# Altium project Relay-Driver-Board-v1.0.PrjPcb (part 4 of 5)
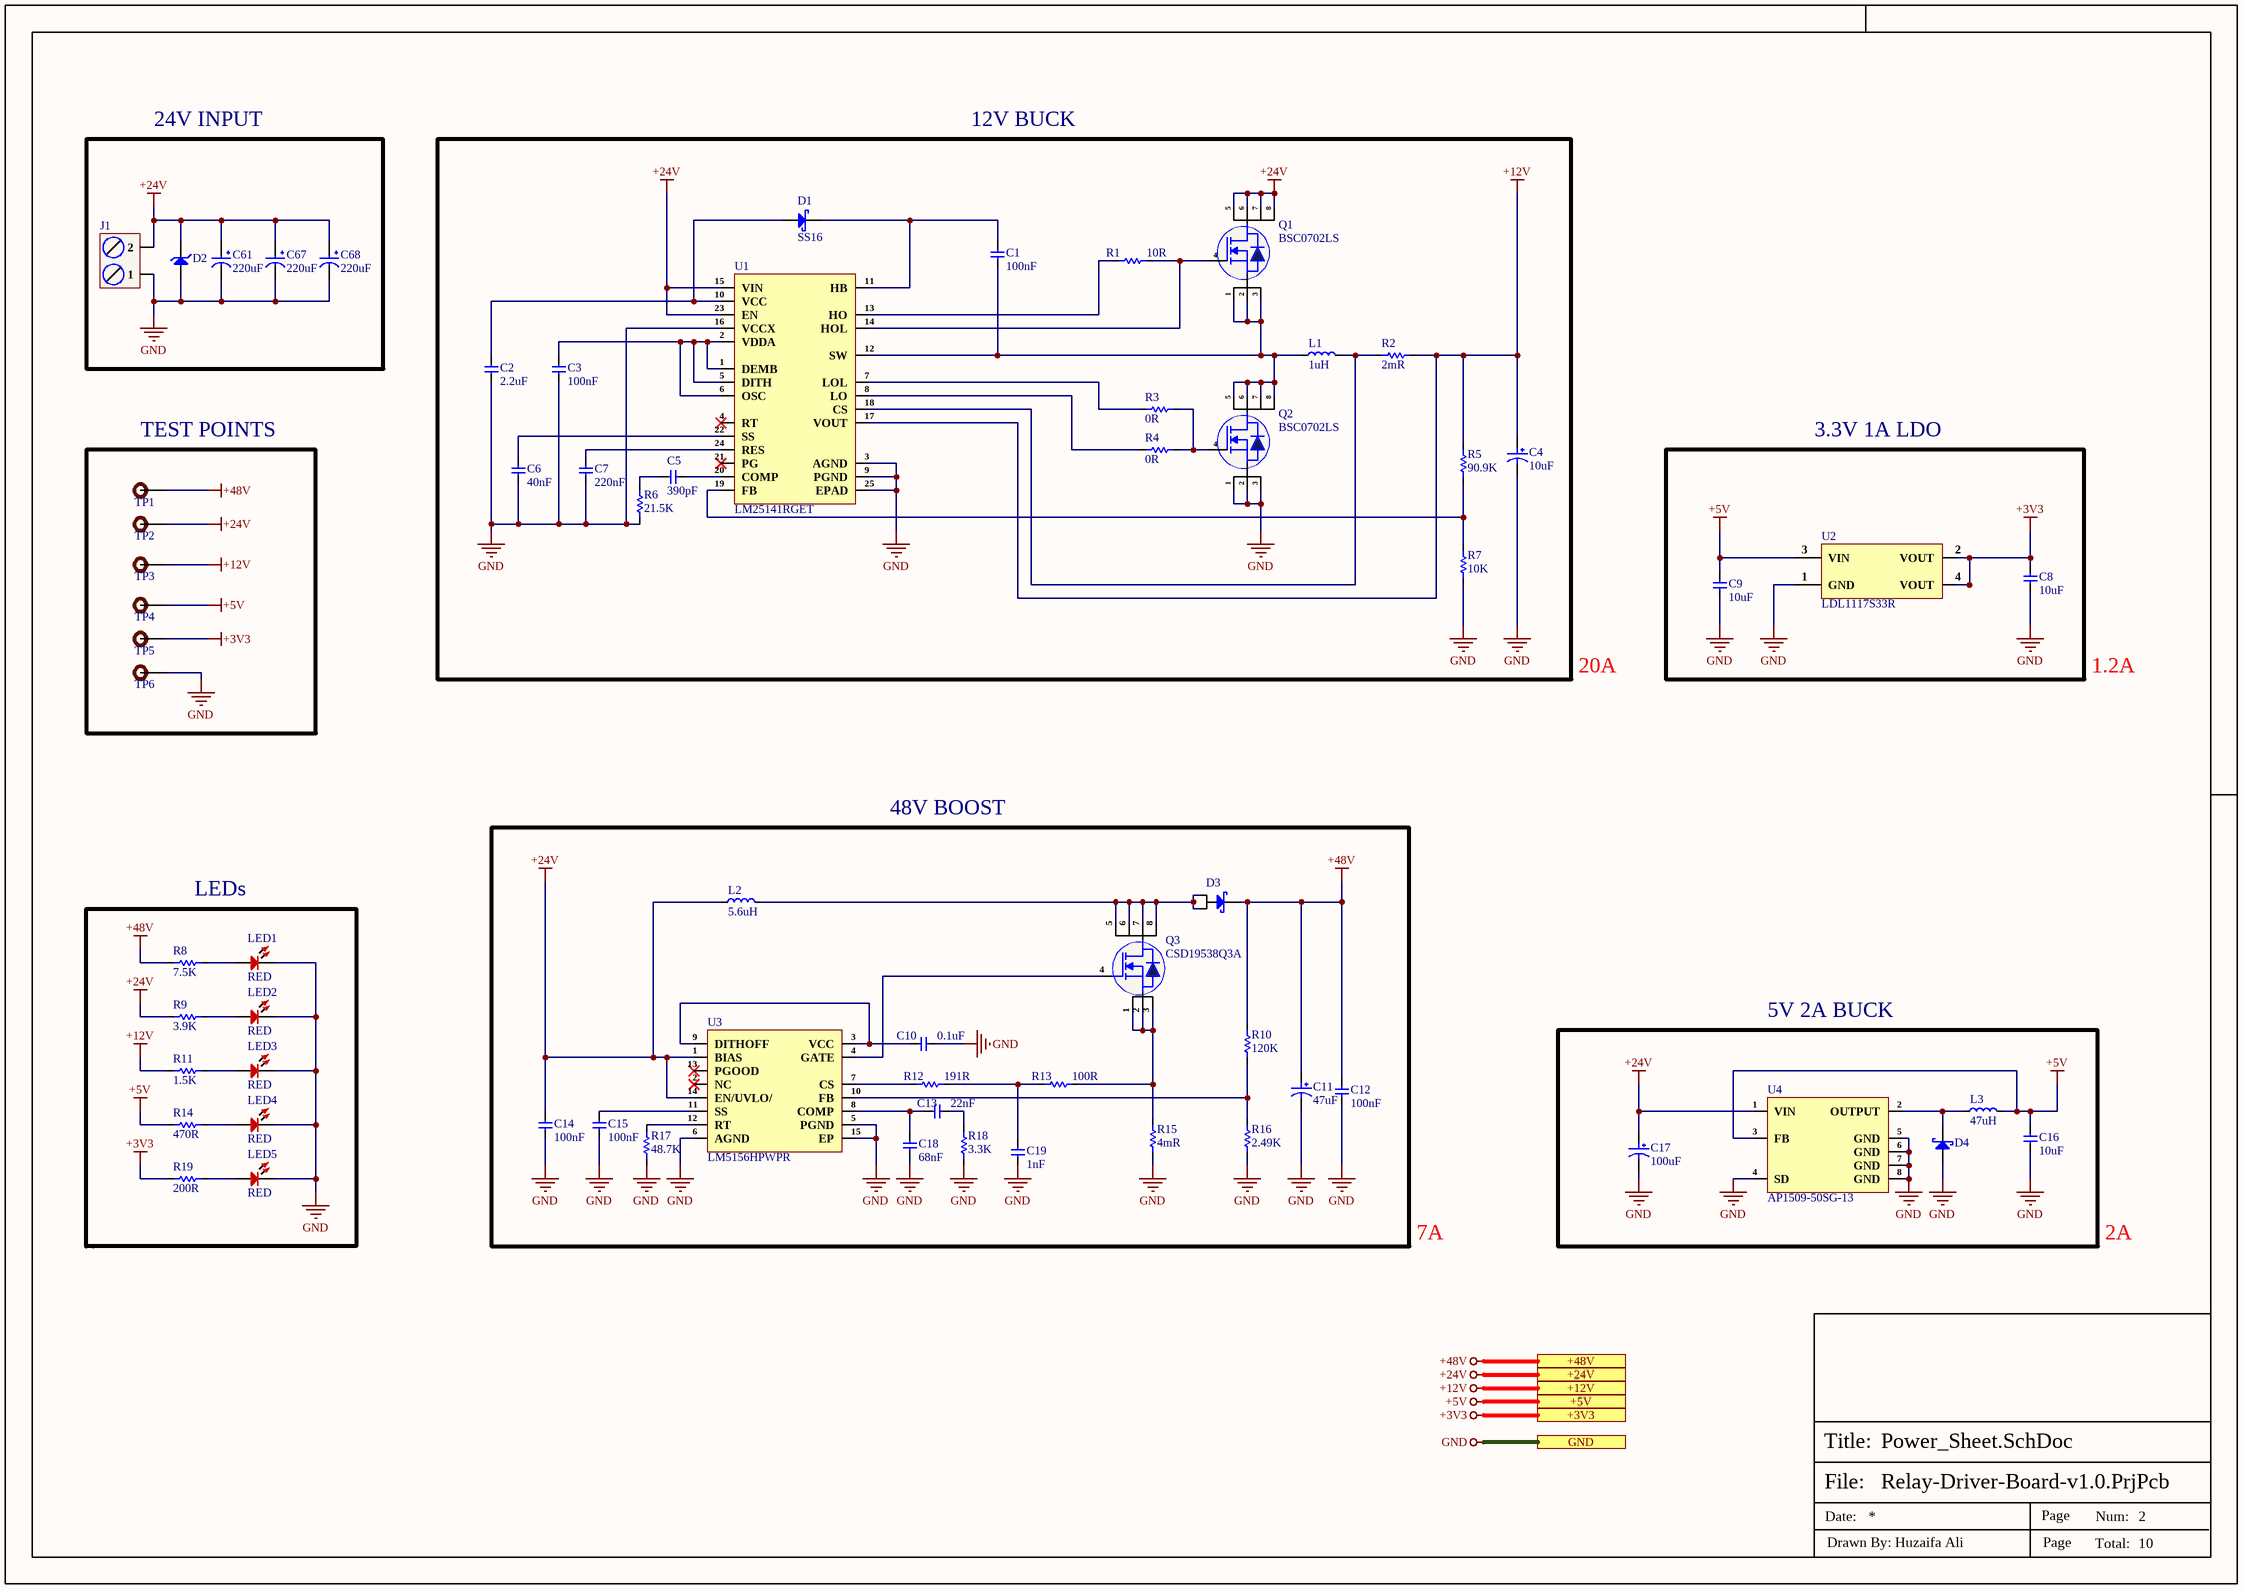
[diagram p10: Power_Sheet.SchDoc]

## Sheet Power_Sheet.SchDoc (continued)
### Library data of the parts
C1 C3 C12 C14 C15 = C1005X7R1H104KT000F: CAP CER 0.1UF 50V X7R 0402; Manufacturer: TDK; Tolerance: 10%; Voltage: 25V; Item Type: Capacitor; Supplier 1: Avnet; Manufacturer Part Number: C1005X7R1H104KT000F; RoHS: No; Category: Ceramic Capacitors; Dielectric: X7R; Supplier Part Number 1: C1005X7R1H104KT000F; LCSC Part Number: C361198; ComponentLink1Description: LCSC; ComponentLink1URL: https://www.lcsc.com/product-detail/Multilayer-Ceramic-Capacitors-MLCC-SMD-SMT_TDK-C1005X7R1H104KT000F_C361198.html
C2 = C2012X5R1H225K125AB: CAP CER 2.2UF 50V X5R 0805; Manufacturer: TDK; Dielectric Material: 4241ConductorMaterial; Item Type: Capacitor; Supplier: Avnet; Supplier Part Number: C2012X5R1H225K125AB; Manufacturer Part Number: C2012X5R1H225K125AB; RoHS: Yes; Category: Ceramic Capacitors; Stock: 6000; Pricing: 2000=0.08532 (USD); Material: 4241ConductorMaterial; Lead Free: 5697LeadFree; ComponentLink1URL: https://datasheet.ciiva.com/24216/c2012x5r1h225k125ab-264892-24216756.pdf?src-supplier=Mouser; ComponentLink1Description: https://datasheet.ciiva.com/24216/c2012x5r1h225k125ab-264892-24216756.pdf?src-supplier=Mouser; ComponentLink2URL: https://datasheet.ciiva.com/6287/tdkmlcccaprange-6287487.pdf?src-supplier=Digikey; ComponentLink2Description: https://datasheet.ciiva.com/6287/tdkmlcccaprange-6287487.pdf?src-supplier=Digikey; ComponentLink3URL: https://datasheet.ciiva.com/6287/tdkmlcccaprange-6287494.pdf?src-supplier=Digikey; ComponentLink3Description: https://datasheet.ciiva.com/6287/tdkmlcccaprange-6287494.pdf?src-supplier=Digikey; ComponentLink4URL: https://datasheet.ciiva.com/6287/tdkmlcccaprange-6287500.pdf?src-supplier=Digikey; ComponentLink4Description: https://datasheet.ciiva.com/6287/tdkmlcccaprange-6287500.pdf?src-supplier=Digikey; ComponentLink5URL: https://datasheet.ciiva.com/28451/1796654-28451710.pdf?src-supplier=Element14; ComponentLink5Description: https://datasheet.ciiva.com/28451/1796654-28451710.pdf?src-supplier=Element14; ComponentLink6URL: https://datasheet.ciiva.com/22725/1913358-22725562.pdf?src-supplier=Element14; ComponentLink6Description: https://datasheet.ciiva.com/22725/1913358-22725562.pdf?src-supplier=Element14
C4 = 50SVPF10M: CAP ALUM POLY 10UF 20% 50V SMD; Manufacturer: Panasonic; Material: 4242ConductorMaterial; Item Type: Capacitor; Supplier: Mouser; Supplier Part Number: 667-50SVPF10M; Manufacturer Part Number: 50SVPF10M; RoHS: Yes; Category: Polymer Capacitors; Stock: 29802; Pricing: 1=1.12, 10=0.801, 50=0.801, 100=0.665, 1000=0.555, 10000=0.504 (USD); ComponentLink1URL: https://datasheet.ciiva.com/48542/svpf-eng-ds-48542427.pdf?src-supplier=Distrelec; ComponentLink1Description: https://datasheet.ciiva.com/48542/svpf-eng-ds-48542427.pdf?src-supplier=Distrelec; ComponentLink2URL: https://datasheet.ciiva.com/24216/svpf-os-262415-24216043.pdf?src-supplier=Mouser; ComponentLink2Description: https://datasheet.ciiva.com/24216/svpf-os-262415-24216043.pdf?src-supplier=Mouser; ComponentLink3URL: https://datasheet.ciiva.com/25761/1734360-25761263.pdf?src-supplier=Farnell; ComponentLink3Description: https://datasheet.ciiva.com/25761/1734360-25761263.pdf?src-supplier=Farnell; LCSC Part Number: C2162323
C5 = CGA2B2C0G1H391J050BA: CAP CER 390PF 50V C0G 0402; Manufacturer: TDK; Item Type: Capacitors; Supplier: Digikey; Supplier Part Number: 445-5603-1-ND; Manufacturer Part Number: CGA2B2C0G1H391J050BA; RoHS: Yes; Stock: 103846; Pricing: 1=0.1, 10=0.048, 50=0.0278, 100=0.0216, 500=0.01622, 1000=0.01275, 2500=0.01159, 5000=0.01066 (USD); ComponentLink1URL: https://datasheet.ciiva.com/24219/cga2b2c0g1h391j050ba-265720-24219960.pdf?src-supplier=Mouser; ComponentLink1Description: https://datasheet.ciiva.com/24219/cga2b2c0g1h391j050ba-265720-24219960.pdf?src-supplier=Mouser; ComponentLink2URL: https://datasheet.ciiva.com/7975/1807242-7975259.pdf?src-supplier=Element14; ComponentLink2Description: https://datasheet.ciiva.com/7975/1807242-7975259.pdf?src-supplier=Element14
C6 = 0805F403M500NT: 50V 40nF Y5V ±20% 0805 Multilayer Ceramic Capacitors MLCC - SMD/SMT ROHS; Manufacturer: FH (Guangdong Fenghua Advanced Tech); Manufacturer Part Number: 0805F403M500NT; Package: 0805; LCSC Part Number: C502151; Item Type: Capacitor; ComponentLink1Description: LCSC; ComponentLink1URL: https://www.lcsc.com/product-detail/Multilayer-Ceramic-Capacitors-MLCC-SMD-SMT_FH-Guangdong-Fenghua-Advanced-Tech-0805F403M500NT_C502151.html
C7 = CC0402KRX5R8BB224: CAP CER 0.22UF 25V X5R 0402; Manufacturer: Yageo; Item Type: Capacitors; Tolerance: 10%; Supplier 1: Mouser; Manufacturer Part Number: CC0402KRX5R8BB224; RoHS: Yes; Stock 1: 61266; Pricing 1: 1=0.10000, 10=0.03300, 50=0.03300, 100=0.02700, 1000=0.01500, 10000=0.01300 (USD); Mount: Surface Mount; Case/Package: 0402; Min Operating Temperature: -55°C; Max Operating Temperature: 85°C; Packaging: Tape and Reel; Capacitance: 220nF; Voltage Rating: 25V; Voltage Rating (DC): 25V; Dielectric: X5R; Length: 0.039inch; Width: 0.02inch; Thickness: 0.022inch; Lead Free: Lead Free; Halogen Free: Halogen Free; RoHS Compliant: Yes; ComponentLink1URL: http://www.yageo.com/documents/recent/UPY-GPHC_X5R_4V-to-50V_25.pdf?src-supplier=Digi-Key; ComponentLink1Description: http://www.yageo.com/documents/recent/UPY-GPHC_X5R_4V-to-50V_25.pdf?src-supplier=Digi-Key; ComponentLink2URL: https://www.yageo.com/upload/media/product/productsearch/datasheet/mlcc/UPY-GPHC_X5R_4V-to-50V_26.pdf?src-supplier=Digi-Key; ComponentLink2Description: https://www.yageo.com/upload/media/product/productsearch/datasheet/mlcc/UPY-GPHC_X5R_4V-to-50V_26.pdf?src-supplier=Digi-Key; ComponentLink3URL: http://www.yageo.com/documents/recent/UPY-GPHC_X5R_4V-to-50V_23.pdf?src-supplier=Digi-Key; ComponentLink3Description: http://www.yageo.com/documents/recent/UPY-GPHC_X5R_4V-to-50V_23.pdf?src-supplier=Digi-Key; Supplier Part Number 1: 603-CC402KRX5R8BB224; LCSC Part Number: C326836
C8 C9 C16 = C1608X5R1E106M080AC: CAP CER 10UF 25V X5R 0603; Manufacturer: TDK; Dielectric Material: Ceramic; Tolerance: 20%; Item Type: Capacitor; Supplier 1: Digi-Key; Manufacturer Part Number: C1608X5R1E106M080AC; Stock 1: 61681; Pricing 1: 1=0.96, 10=0.704, 100=0.483, 500=0.38238, 1000=0.322 (USD); Mount: Surface Mount; Case/Package: 0603; Weight: 7.1E-05oz; Case Code (Imperial): 0603; Case Code (Metric): 1608; Min Operating Temperature: -55°C; Max Operating Temperature: 85°C; Capacitance: 10uF; Packaging: Tape and Reel; Voltage Rating: 25V; Voltage Rating (DC): 25V; Termination: SMD/SMT; Package Quantity: 1; Dielectric: X5R; Composition: Ceramic; Length: 1.6mm; Height: 0.8mm; Width: 0.8mm; Thickness: 0.039inch; Depth: 0.8mm; Lead Free: Lead Free; REACH SVHC: No SVHC; Supplier Part Number 1: 445-9015-1-ND; LCSC Part Number: C2168289
C10 = CC0402JRX7R7BB104: CAP CER 0.1UF 16V X7R 0402; Manufacturer: Yageo; Material: 4241ConductorMaterial; Value: 100nF; Tolerance: 5%; Item Type: Capacitor; Supplier: Digikey; Supplier Part Number: 311-1676-1-ND; Manufacturer Part Number: CC0402JRX7R7BB104; RoHS: Yes; Category: Ceramic Capacitors; Stock: 1659111; Pricing: 1=0.1, 10=0.046, 50=0.0262, 100=0.0203, 500=0.01528, 1000=0.012, 2500=0.01091, 5000=0.01004 (USD); Mounting Technology: Surface Mount; Case/Package: 0402; Case Code (Metric): 1005; Case Code (Imperial): 0402; Min Operating Temperature: -55°C; Max Operating Temperature: 125°C; Dielectric: X7R; Packaging: Tape and Reel; Package Quantity: 10000; Voltage Rating (DC): 16V; Voltage Rating: 16V; Series: CC; Construction: Flat; Length: 0.039inch; Width: 0.02inch; Height: 0.5mm; Thickness: 0.022inch; Lead Free: Lead Free; Halogen Free: Halogen Free; RoHS Compliant: Yes; ComponentLink1URL: https://datasheet.ciiva.com/13210/upy-gphc-x7r-6-3v-to-50v-8-12304-13210152.pdf?src-supplier=Mouser; ComponentLink1Description: https://datasheet.ciiva.com/13210/upy-gphc-x7r-6-3v-to-50v-8-12304-13210152.pdf?src-supplier=Mouser; LCSC Part Number: C541464
C11 = 25SVPF47M: CAP ALUM POLY 47UF 20% 25V SMD; Manufacturer: Panasonic; Dielectric Material: Aluminium; Polarity: Polarized; ESR (Equivalent Series Resistance): 30mR; Leakage Current: 235uA; Ripple Current: 140mA; Tan Delta: 0.12; Item Type: Capacitor; Supplier 1: Avnet; Manufacturer Part Number: 25SVPF47M; RoHS: Yes; Category: Polymer Capacitors; Stock 1: 1000; Pricing 1: 1000=0.43572, 2000=0.42658, 4000=0.41744, 6000=0.40830, 8000=0.39916 (USD); Mounting Technology: Surface Mount; Pins: 2; Package Shape: Cylindrical; Case/Package: 2626; Min Operating Temperature: -55°C; Max Operating Temperature: 105°C; Value: 47uF; Capacitor Type: Aluminium; Tolerance  (fill in as +-): 20%; Package Style: SMTMeter; Packaging: Tape and Reel; Tolerance (fill in as +-): 20%; Rated DC Voltage (URdc): 25V; Termination: Flat; Length: 7.3mm; Width: 6.6mm; Height: 5.9mm; Reach SVHC Compliant: Yes; RoHS Compliant: Yes; ComponentLink1URL: https://datasheet.ciiva.com:443/pdfs/VipMasterIC/IC/PANA/PANA-S-A0008969958/PANA-S-A0008969958-1.pdf?src-supplier=IHS+Markit; ComponentLink1Description: https://datasheet.ciiva.com:443/pdfs/VipMasterIC/IC/PANA/PANA-S-A0008969958/PANA-S-A0008969958-1.pdf?src-supplier=IHS+Markit; ComponentLink2URL: https://datasheet.ciiva.com/48542/svpf-eng-ds-48542390.pdf?src-supplier=Distrelec; ComponentLink2Description: https://datasheet.ciiva.com/48542/svpf-eng-ds-48542390.pdf?src-supplier=Distrelec; ComponentLink3URL: https://datasheet.ciiva.com/25746/1734360-25746558.pdf?src-supplier=Farnell; ComponentLink3Description: https://datasheet.ciiva.com/25746/1734360-25746558.pdf?src-supplier=Farnell; ComponentLink4URL: https://datasheet.ciiva.com/22746/1734360-22746218.pdf?src-supplier=Element14; ComponentLink4Description: https://datasheet.ciiva.com/22746/1734360-22746218.pdf?src-supplier=Element14; ComponentLink5URL: https://datasheet.ciiva.com/24025/svpf-os-262415-24025725.pdf?src-supplier=Mouser; ComponentLink5Description: https://datasheet.ciiva.com/24025/svpf-os-262415-24025725.pdf?src-supplier=Mouser; Supplier Part Number 1: 25SVPF47M; LCSC Part Number: C136280
C13 = CC0402JRX7R7BB223: CAP CER 0.022UF 16V X7R 0402; Manufacturer: Yageo; Tolerance: 5%; Item Type: Capacitor; Supplier: Digikey; Supplier Part Number: 311-3758-1-ND; Manufacturer Part Number: CC0402JRX7R7BB223; RoHS: Yes; Category: Ceramic Capacitors; Stock: 4203; Pricing: 1=0.1, 10=0.033, 50=0.0192, 100=0.0149, 500=0.0112, 1000=0.0088, 2500=0.008, 5000=0.00736 (USD); Mounting Technology: Surface Mount; Case/Package: 0402; Case Code (Imperial): 0402; Case Code (Metric): 1005; Weight: 2.3E-05oz; Min Operating Temperature: -55°C; Max Operating Temperature: 125°C; Value: 22nF; Packaging: Tape and Reel; Voltage Rating: 16V; Voltage Rating (DC): 16V; Dielectric: X7R; Termination: SMD/SMT; Series: CC; Length: 0.039inch; Width: 0.5mm; Thickness: 0.022inch; RoHS Compliant: Yes; Halogen Free: 5694HalogenFree; Lead Free: 5697LeadFree; ComponentLink1URL: https://datasheet.ciiva.com/13264/upy-gphc-x7r-6-3v-to-50v-8-12304-13264039.pdf?src-supplier=Mouser; ComponentLink1Description: https://datasheet.ciiva.com/13264/upy-gphc-x7r-6-3v-to-50v-8-12304-13264039.pdf?src-supplier=Mouser; LCSC Part Number: C541459
C17 = RVT1A101M0605: 100uF 10V 55mA@120Hz ±20% SMD,D6.3xL5.4mm Aluminum Electrolytic Capacitors - SMD ROHS; Manufacturer: ROQANG; Manufacturer Part Number: RVT1A101M0605; Package: SMD,D6.3xL5.4mm; LCSC Part Number: C72474; Item Type: Capacitor; ComponentLink1Description: LCSC; ComponentLink1URL: https://www.lcsc.com/product-detail/Aluminum-Electrolytic-Capacitors-SMD_ROQANG-RVT1A101M0605_C72474.html
C18 = CC0402KRX7R9BB683: CAP CER 0.068UF 50V X7R 0402; Manufacturer: Yageo; Dielectric: 1511DielectricType; Item Type: Capacitor; Supplier 1: Future Electronics; Manufacturer Part Number: CC0402KRX7R9BB683; RoHS: Yes; Category: Ceramic Capacitors; Stock 1: 100000; Pricing 1: 10000=0.0035, 40000=0.0033, 100000=0.0032, 250000=0.0031, 400000=0.0029 (USD); Case/Package: 343Case; Capacitance: 68nF; Voltage Rating (DC): 50V; Halogen Free: 5694HalogenFree; Lead Free: 5697LeadFree; Supplier Part Number 1: 2106471
C19 = C1005C0G1E102JT000F: CAP CER 1000PF 25V C0G 0402; Manufacturer: TDK; Item Type: Capacitor; ComponentLink1Description: LCSC; ComponentLink1URL: https://www.lcsc.com/product-detail/Multilayer-Ceramic-Capacitors-MLCC-SMD-SMT_TDK-C1005C0G1E102JT000F_C343059.html; Manufacturer Part Number: C1005C0G1E102JT000F; Package: 0402; LCSC Part Number: C343059
C61 C67 C68 = UCD1H221MNL1GS: CAP ALUM 220UF 20% 50V SMD; Manufacturer: Nichicon; Ripple Current: 700mA; Impedance: 160mR; Leakage Current: 3uA; Life (Hours): 5000Hour; Dissipation Factor: 0.1%; Item Type: Capacitor; Supplier 1: Digi-Key; Manufacturer Part Number: UCD1H221MNL1GS; RoHS: Yes; Category: Aluminum Electrolytic Capacitors; Pricing 1: 1=0.85000, 10=0.60200, 50=0.45480, 100=0.39620 (USD); Mount: Surface Mount,PCB; Case/Package: Radial; Min Operating Temperature: -55°C; Max Operating Temperature: 105°C; Capacitance: 220uF; Tolerance: 20%; Voltage Rating: 50V; Packaging: Tape and Reel; Package Quantity: 1; Voltage Rating (DC): 50V; Termination: SMD/SMT; Voltage: 50V; Features: General Purpose; Series: CD; Construction: Cylindrical; Diameter: 10mm; Length: 10mm; Height: 10mm; Height - Seated (Max): 0.394inch; Radiation Hardening: No; Lead Free: Lead Free; RoHS Compliant: Yes; ComponentLink1URL: https://datasheet.ciiva.com/11776/0900766b80ebdadd-11776792.pdf?src-supplier=RSComponents; ComponentLink1Description: https://datasheet.ciiva.com/11776/0900766b80ebdadd-11776792.pdf?src-supplier=RSComponents; ComponentLink2URL: https://datasheet.ciiva.com/5362/e-cd-22158-5362489.pdf?src-supplier=Mouser; ComponentLink2Description: https://datasheet.ciiva.com/5362/e-cd-22158-5362489.pdf?src-supplier=Mouser; ComponentLink3URL: https://datasheet.ciiva.com/11684/e-cd-11684678.pdf?src-supplier=Avnet; ComponentLink3Description: https://datasheet.ciiva.com/11684/e-cd-11684678.pdf?src-supplier=Avnet; ComponentLink4URL: https://datasheet.ciiva.com/15037/e-cd-15037119.pdf?src-supplier=Digi-Key; ComponentLink4Description: https://datasheet.ciiva.com/15037/e-cd-15037119.pdf?src-supplier=Digi-Key; ComponentLink5URL: https://datasheet.ciiva.com/16393/e-cd-16393493.pdf?src-supplier=Future+Electronics; ComponentLink5Description: https://datasheet.ciiva.com/16393/e-cd-16393493.pdf?src-supplier=Future+Electronics; ComponentLink6URL: https://datasheet.ciiva.com/17354/e-cd-17354606.pdf?src-supplier=Avnet+Europe; ComponentLink6Description: https://datasheet.ciiva.com/17354/e-cd-17354606.pdf?src-supplier=Avnet+Europe; Supplier Part Number 1: 493-6390-1-ND; LCSC Part Number: C116211
D1 = SS16: 60V 700mV@1A 1A SMA(DO-214AC) Schottky Barrier Diodes (SBD) ROHS; Manufacturer: MDD; Item Type: Schottky Diode; Manufacturer Part Number: SS16; Package: SMA(DO-214AC); LCSC Part Number: C2481; ComponentLink1Description: LCSC; ComponentLink1URL: https://www.lcsc.com/product-detail/Schottky-Barrier-Diodes-SBD_MDD-Microdiode-Electronics-SS16_C2481.html
D2 = SMBJ28A-13-F: TVS DIODE 28VWM 45.4VC SMB; Manufacturer: Diodes; Test Current: 1mA; Number of Elements: 1; Power Dissipation: 600W; Forward Voltage: 5V; Direction: Unidirectional; Reverse Breakdown Voltage: 31.1V; Max Surge Current: 13.2A; Reverse Standoff Voltage: 28V; Clamping Voltage: 45.4V; Power Line Protection: No; Breakdown Voltage: 35.8V; Max Reverse Leakage Current: 5uA; Value: 330pF; Diode Type: ZENER; Supplier: Future Electronics; Supplier Part Number: 8797342; Manufacturer Part Number: SMBJ28A-13-F; RoHS: Yes; Category: TVS Diodes; Stock: 39000; Pricing: 3000=0.0734, 9000=0.0706, 15000=0.0693, 30000=0.0676, 60000=0.065 (USD); Mounting Technology: Surface Mount; Case/Package: SMB; Pins: 2; Min Operating Temperature: -55°C; Max Operating Temperature: 150°C; Packaging: Tape and Reel; Package Quantity: 3000; Max Power Dissipation: 600W; Series: SMBJ; Number of Unidirectional Channels: 1; Min Breakdown Voltage: 31.1V; Peak Pulse Power: 600W; Polarity: Unidirectional; Termination: SMD/SMT; Peak Pulse Current: 13.2A; Max Breakdown Voltage: 35.8V; Leakage Current: 5uA; Working Voltage: 28V; Voltage Rating (DC): 28V; Max Output current: 13.2A; Clamping Voltage-Max: 45.4V; Length: 4.57mm; Width: 3.9mm; Height: 2.62mm; Radiation Hardening: No; RoHS Compliant: Yes; Lead Free: Lead Free; ComponentLink1URL: https://datasheet.ciiva.com/16387/ds19002-16387564.pdf?src-supplier=Future+Electronics; ComponentLink1Description: https://datasheet.ciiva.com/16387/ds19002-16387564.pdf?src-supplier=Future+Electronics; ComponentLink2URL: https://datasheet.ciiva.com/26912/getdatasheetpartid-234000-26912533.pdf?src-supplier=Verical; ComponentLink2Description: https://datasheet.ciiva.com/26912/getdatasheetpartid-234000-26912533.pdf?src-supplier=Verical; Item Type: Diode
D3 = STPS20M100SG-TR: DIODE SCHOTTKY 100V 20A D2PAK; Manufacturer: STMicroelectronics; Supplier: Mouser; Supplier Part Number: 511-STPS20M100SG-TR; Manufacturer Part Number: STPS20M100SG-TR; RoHS: Yes; Category: Rectifier Diodes; Stock: 6295; Pricing: 1=2.95, 10=2.48, 50=2.48, 100=2.01, 1000=1.53, 10000=1.38 (USD); ComponentLink1URL: https://datasheet.ciiva.com/16356/cd00228904-16356744.pdf?src-supplier=Future+Electronics; ComponentLink1Description: https://datasheet.ciiva.com/16356/cd00228904-16356744.pdf?src-supplier=Future+Electronics; ComponentLink2URL: https://datasheet.ciiva.com/917/cd00228904-917526.pdf?src-supplier=Digikey; ComponentLink2Description: https://datasheet.ciiva.com/917/cd00228904-917526.pdf?src-supplier=Digikey; ComponentLink3URL: https://datasheet.ciiva.com/917/cd00228904-917527.pdf?src-supplier=Digikey; ComponentLink3Description: https://datasheet.ciiva.com/917/cd00228904-917527.pdf?src-supplier=Digikey; LCSC Part Number: C969989; Item Type: Diode
D4 = B150-13-F: DIODE SCHOTTKY 50V 1A SMA; Manufacturer: Diodes Incorporated; Manufacturer Part Number: B150-13-F; Package: SMA(DO-214AC); LCSC Part Number: C134431; Item Type: Diode
J1 = MXHB9500-9.5-02P-BK01-Cu-S-A: Tin 1x2P Corner pin Three sides 2 1 9.5mm -40℃~+105℃ 20A 300V Black 10~22 Copper Alloy 0.5~4 Plugin,P=9.5mm Barrier Terminal Blocks ROHS; Manufacturer: MAX; Manufacturer Part Number: MXHB9500-9.5-02P-BK01-Cu-S-A; Package: Plugin,P=9.5mm; LCSC Part Number: C7542168; Item Type: Terminal Block; ComponentLink1Description: LCSC; ComponentLink1URL: https://www.lcsc.com/product-detail/Barrier-Terminal-Blocks_MAX-MXHB9500-9-5-02P-BK01-Cu-S-A_C7542168.html
L1 = FCM1250-1R0M-L-S: 25.5A 1uH Molding Choke ±20% 37A SMD,13.5x12.5mm Power Inductors ROHS; Manufacturer: FANGCHENG; Manufacturer Part Number: FCM1250-1R0M-L-S; Package: SMD,13.5x12.5mm; LCSC Part Number: C5142781; Item Type: Inductor; ComponentLink1Description: LCSC; ComponentLink1URL: https://www.lcsc.com/product-detail/Power-Inductors_FANGCHENG-FCM1250-1R0M-L-S_C5142781.html
L2 = FXL1360-5R6-M: 18A 5.6uH Integrated molded inductor ±20% 22.5A SMD,12.6x13.5mm Power Inductors ROHS; Manufacturer: cjiang; Manufacturer Part Number: FXL1360-5R6-M; Package: SMD,12.6x13.5mm; LCSC Part Number: C526022; Item Type: Inductor; ComponentLink1Description: LCSC; ComponentLink1URL: https://www.lcsc.com/product-detail/Power-Inductors_cjiang-Changjiang-Microelectronics-Tech-FXL1360-5R6-M_C526022.html
L3 = CYA0650-47UH: 2A 47uH ±20% 250mΩ SMD,6.6x7.2mm Inductors (SMD) ROHS; Manufacturer: SHOU HAN; Manufacturer Part Number: CYA0650-47UH; Package: SMD,6.6x7.2mm; LCSC Part Number: C5189938; Item Type: Inductor; ComponentLink1Description: LCSC; ComponentLink1URL: https://www.lcsc.com/product-detail/Inductors-SMD_SHOU-HAN-CYA0650-47UH_C5189938.html
LED1-LED5 = NCD0603R3: RED LED 0603 Light Emitting Diodes; Manufacturer: Foshan NationStar Optoelectronics; Manufacturer Part Number: NCD0603R3; Package: 0603; Item Type: LED; LCSC Part Number: C3151730; ComponentLink1Description: LCSC; ComponentLink1URL: https://www.lcsc.com/product-detail/Light-Emitting-Diodes-LED_Foshan-NationStar-Optoelectronics-NCD0603R3_C3151730.html
Q1 Q2 = BSC0702LS: MOSFET N-CH 60V 100A SUPERSO8; Manufacturer: Infineon; Manufacturer Part Number: BSC0702LSATMA1; Item Type: Transistor; Supplier 1: Digi-Key; RoHS: No; Category: MOSFETs; Stock 1: 9380; Pricing 1: 1=1.88000, 10=1.69000, 100=1.35800, 500=1.11572, 1000=0.92978 (USD); LCSC Part Number: C501503; Supplier Part Number 1: 448-BSC0702LSATMA1CT-ND; ComponentLink1Description: LCSC; ComponentLink1URL: https://www.lcsc.com/product-detail/MOSFETs_Infineon-Technologies-BSC0702LS_C501503.html
Q3 = CSD19538Q3A: MOSFET N-CH 100V 15A 8VSON; Manufacturer: Texas Instruments; Item Type: IC; Drain to Source Resistance: 49mR; Gate to Source Voltage (Vgs): 20V; Number of Channels: 1NUMBER; Power Dissipation: 2.8W; Turn-Off Delay Time: 7ns; Turn-On Delay Time: 5ns; Supplier: Mouser; LCSC Part Number: C478471; Manufacturer Part Number: CSD19538Q3A; RoHS: Yes; Stock: 14931; Pricing: 1=0.57, 10=0.496, 50=0.496, 100=0.343, 1000=0.244, 10000=0.19 (USD); Drain to Source Breakdown Voltage: 100V; Length: 3.3mm; Width: 3.3mm; Height: 900um; Thickness: 800um; Lead Free: 5697LeadFree; ComponentLink1URL: http://www.ti.com/lit/ds/symlink/csd19538q3a.pdf?src-supplier=Digikey; ComponentLink1Description: http://www.ti.com/lit/ds/symlink/csd19538q3a.pdf?src-supplier=Digikey
R1 = CRCW040210R0FKEDHP: RES SMD 10 OHM 1% 1/5W 0402; Manufacturer: Vishay Dale; Power Rating: 125mW; Voltage Rating: 50V; Temperature Coefficient: 100ppm/°C; Max Power Dissipation: 200mW; Supplier 1: Digi-Key; Manufacturer Part Number: CRCW040210R0FKEDHP; Stock 1: 28500; Pricing 1: 1=0.15, 10=0.132, 100=0.0506, 1000=0.02226, 2500=0.01923, 5000=0.0172 (USD); Mount: Surface Mount; Case/Package: 0402; Weight: 2.3E-05oz; Case Code (Imperial): 0402; Case Code (Metric): 1005; Contact Plating: Tin; Min Operating Temperature: -55°C; Max Operating Temperature: 155°C; Resistance: 10R; Tolerance: 1%; Packaging: Tape and Reel; Package Quantity: 10000; Termination: SMD/SMT; Resistor Type: Thick Film; Voltage Rating (DC): 50V; Features: Automotive AEC-Q200; Series: CRCW-HP; Number of Terminations: 2; Resistance Tolerance: 1%; Technology: THICK FILM; Construction: Rectangular; Length: 1mm; Width: 0.5mm; Height: 0.3mm; Depth: 0.5mm; Radiation Hardening: No; REACH SVHC: Unknown; Military Standard: Not; Lead Free: Lead Free; RoHS Compliant: Yes; ComponentLink1URL: http://www.mouser.com/ds/2/427/crcwhpe3-46056.pdf?src-supplier=Mouser; ComponentLink1Description: http://www.mouser.com/ds/2/427/crcwhpe3-46056.pdf?src-supplier=Mouser; Supplier Part Number 1: 541-10.0YCT-ND; LCSC Part Number: C4013850
R2 = ASR-F-5-2F: 6W 2mΩ Surface Mount Shunt ±50ppm/℃ ±1% 3920 Current Sense Resistors / Shunt Resistors ROHS; Manufacturer: Shenzhen Yezhan Elec; Manufacturer Part Number: ASR-F-5-2F; Package: 3920; LCSC Part Number: C469436; Item Type: Resistors; ComponentLink1Description: LCSC; ComponentLink1URL: https://www.lcsc.com/product-detail/Current-Sense-Resistors-Shunt-Resistors_Shenzhen-Yezhan-Elec-ASR-F-5-2F_C469436.html
R3 R4 = RC0402FR-070RL: RES 0 OHM JUMPER 1/16W 0402; Manufacturer: Yageo; Item Type: Resistors; Tolerance: 1%; Power Rating: 62.5mW; Voltage Rating: 50V; Temperature Coefficient: 200ppm/°C; Max Power Dissipation: 63mW; Supplier 1: Mouser; Manufacturer Part Number: RC0402FR-070RL; RoHS: Yes; Stock 1: 8556842; Pricing 1: 1=0.10000, 10=0.01400, 50=0.01400, 100=0.00600, 1000=0.00300, 5000=0.00200, 10000=0.00100 (USD); Mount: Surface Mount; Case/Package: 0402; Contact Plating: Tin,Matte; Case Code (Imperial): 0402; Case Code (Metric): 1005; Size Code: 0402; Min Operating Temperature: -55°C; Max Operating Temperature: 155°C; Resistance: 0R; Resistor Type: Thick Film; Packaging: Tape and Reel; Termination: SMD/SMT; Features: Moisture Resistant; Series: RC; Number of Terminations: 2; Length: 1mm; Width: 0.5mm; Height: 0.35mm; Radiation Hardening: No; Lead Free: Lead Free; RoHS Compliant: Yes; ComponentLink1URL: https://datasheet.ciiva.com/8896/pyu-rc0402-51-rohs-l-6-8896149.pdf?src-supplier=Avnet; ComponentLink1Description: https://datasheet.ciiva.com/8896/pyu-rc0402-51-rohs-l-6-8896149.pdf?src-supplier=Avnet; ComponentLink2URL: https://datasheet.ciiva.com/16790/pyu-rc0402-51-rohs-l-6-r-16790444.pdf?src-supplier=Future+Electronics; ComponentLink2Description: https://datasheet.ciiva.com/16790/pyu-rc0402-51-rohs-l-6-r-16790444.pdf?src-supplier=Future+Electronics; Supplier Part Number 1: 603-RC0402FR-070RL; LCSC Part Number: C106231
R5 = AT0402DRD0790K9L: RES SMD 90.9KOHM 0.5% 1/16W 0402; Manufacturer: Yageo; Item Type: Resistor; Value: 90.9kR; Max Power Dissipation: 63mW; Temperature Coefficient: 25ppm/°C; Supplier: Digikey; LCSC Part Number: C851529; Manufacturer Part Number: AT0402DRD0790K9L; RoHS: Yes; Pricing: 10000=0.03114 (USD); Case/Package: 0402; Min Operating Temperature: -55°C; Max Operating Temperature: 155°C; Packaging: Tape and Reel; Number of Terminations: 2; Tolerance: 0.5%; Features: Moisture Resistant,Automotive AEC-Q200,Anti-Sulfur; Series: AT; Length: 0.039inch; Width: 0.02inch; Height: 0.014inch; RoHS Compliant: Yes; ComponentLink1URL: http://www.yageo.com/documents/recent/PYu-AT_51_RoHS_L-3.pdf?src-supplier=Digikey; ComponentLink1Description: http://www.yageo.com/documents/recent/PYu-AT_51_RoHS_L-3.pdf?src-supplier=Digikey
R6 = 0402WGF2152TCE: 62.5mW Thick Film Resistors 50V ±100ppm/℃ ±1% 21.5kΩ 0402 Chip Resistor - Surface Mount ROHS; Manufacturer: Uniroyal; Supplier: LCSC; LCSC Part Number: C25872; Manufacturer Part Number: 0402WGF2152TCE; RoHS: No; Item Type: Resistor
R7 = RC0402FR-0710KL: RES 10K OHM 1% 1/16W 0402; Manufacturer: Yageo; Resistance: 10kR; Voltage Rating (DC): 50V; Temperature Coefficient: 100ppm/°C; Power Rating: 62.5mW; Max Power Dissipation: 63mW; Item Type: Resistor; Supplier 1: Mouser; Manufacturer Part Number: RC0402FR-0710KL; RoHS: Yes; Category: Chip SMD Resistors; Stock 1: 18648329; Pricing 1: 1=0.10000, 10=0.01400, 50=0.01400, 100=0.00500, 1000=0.00300, 10000=0.00200 (USD); Case/Package: 0402; Number of Pins: 2; Case Code (Imperial): 0402; Case Code (Metric): 1005; Min Operating Temperature: -55°C; Max Operating Temperature: 155°C; Resistor Type: Thick Film; Tolerance: 1%; Packaging: Tape and Reel; Voltage Rating: 50V; Termination: SMD/SMT; Working Voltage: 50V; Number of Terminations: 2; Features: Moisture Resistant; Series: RC; Resistance Tolerance: 1%; Construction: Rectangular; Length: 1mm; Width: 0.5mm; Height: 0.32mm; Depth: 0.5mm; Lead Pitch: 0.2mm; REACH SVHC: No SVHC; Lead Free: Lead Free; RoHS Compliant: Yes; Military Standard: Not; ComponentLink1URL: https://datasheet.ciiva.com/7660/38568-7660787.pdf?src-supplier=Element14; ComponentLink1Description: https://datasheet.ciiva.com/7660/38568-7660787.pdf?src-supplier=Element14; ComponentLink2URL: https://datasheet.ciiva.com/7849/1686128-7849814.pdf?src-supplier=Element14; ComponentLink2Description: https://datasheet.ciiva.com/7849/1686128-7849814.pdf?src-supplier=Element14; ComponentLink3URL: https://datasheet.ciiva.com/7983/1018594-7983486.pdf?src-supplier=Element14; ComponentLink3Description: https://datasheet.ciiva.com/7983/1018594-7983486.pdf?src-supplier=Element14; ComponentLink4URL: https://datasheet.ciiva.com/22747/1018594-22747512.pdf?src-supplier=Element14; ComponentLink4Description: https://datasheet.ciiva.com/22747/1018594-22747512.pdf?src-supplier=Element14; ComponentLink5URL: https://datasheet.ciiva.com/12667/pyu-rc0402-51-rohs-l-6-r-12667067.pdf?src-supplier=Mouser; ComponentLink5Description: https://datasheet.ciiva.com/12667/pyu-rc0402-51-rohs-l-6-r-12667067.pdf?src-supplier=Mouser; ComponentLink6URL: https://datasheet.ciiva.com/7849/1784430-7849813.pdf?src-supplier=Element14; ComponentLink6Description: https://datasheet.ciiva.com/7849/1784430-7849813.pdf?src-supplier=Element14; ComponentLink7URL: https://datasheet.ciiva.com/7849/1784430-7849815.pdf?src-supplier=Element14; ComponentLink7Description: https://datasheet.ciiva.com/7849/1784430-7849815.pdf?src-supplier=Element14; Supplier Part Number 1: 603-RC0402FR-0710KL; LCSC Part Number: C60490
R8 = RC0402FR-077K5L: RES 7.5K OHM 1% 1/16W 0402; Manufacturer: Yageo; Resistance: 7.5kR; Power Rating: 63mW; Voltage Rating: 50V; Temperature Coefficient: 100ppm/°C; Item Type: Resistor; Supplier 1: Digi-Key; Manufacturer Part Number: RC0402FR-077K5L; RoHS: Yes; Category: Chip SMD Resistors; Stock 1: 1313734; Pricing 1: 1=0.10000, 10=0.01400, 100=0.00580, 1000=0.00262, 2500=0.00228, 5000=0.00188 (USD); Case/Package: 0402; Case Code (Metric): 1005; Case Code (Imperial): 0402; Size Code: 0402; Min Operating Temperature: -55°C; Max Operating Temperature: 155°C; Tolerance: 1%; Package Quantity: 1; Packaging: Tape and Reel; Resistor Type: Thick Film; Number of Terminations: 2; Termination: SMD/SMT; Max Power Dissipation: 63mW; Voltage Rating (DC): 50V; Features: Moisture Resistant; Series: RC; Resistance Tolerance: 1%; Construction: Rectangular; Length: 0.039inch; Width: 0.02inch; Height: 0.016inch; Depth: 0.5mm; Military Standard: Not; Lead Free: Lead Free; RoHS Compliant: Yes; ComponentLink1URL: https://datasheet.ciiva.com/7850/1018594-7850095.pdf?src-supplier=Element14; ComponentLink1Description: https://datasheet.ciiva.com/7850/1018594-7850095.pdf?src-supplier=Element14; ComponentLink2URL: https://datasheet.ciiva.com/7983/1018594-7983527.pdf?src-supplier=Element14; ComponentLink2Description: https://datasheet.ciiva.com/7983/1018594-7983527.pdf?src-supplier=Element14; ComponentLink3URL: https://datasheet.ciiva.com/46394/1018594-46394939.pdf?src-supplier=Element14; ComponentLink3Description: https://datasheet.ciiva.com/46394/1018594-46394939.pdf?src-supplier=Element14; ComponentLink4URL: https://datasheet.ciiva.com/2519/pyu-r-int-thick-7-2519058.pdf?src-supplier=Digi-Key; ComponentLink4Description: https://datasheet.ciiva.com/2519/pyu-r-int-thick-7-2519058.pdf?src-supplier=Digi-Key; ComponentLink5URL: https://datasheet.ciiva.com/2519/pyu-r-int-thick-7-2519059.pdf?src-supplier=Digi-Key; ComponentLink5Description: https://datasheet.ciiva.com/2519/pyu-r-int-thick-7-2519059.pdf?src-supplier=Digi-Key; ComponentLink6URL: https://datasheet.ciiva.com/2519/pyu-r-int-thick-7-2519057.pdf?src-supplier=Digi-Key; ComponentLink6Description: https://datasheet.ciiva.com/2519/pyu-r-int-thick-7-2519057.pdf?src-supplier=Digi-Key; ComponentLink7URL: https://datasheet.ciiva.com/12667/pyu-rc0402-51-rohs-l-6-r-12667366.pdf?src-supplier=Mouser; ComponentLink7Description: https://datasheet.ciiva.com/12667/pyu-rc0402-51-rohs-l-6-r-12667366.pdf?src-supplier=Mouser; ComponentLink8URL: https://datasheet.ciiva.com/16741/pyu-rc0402-51-rohs-l-6-r-16741132.pdf?src-supplier=Future+Electronics; ComponentLink8Description: https://datasheet.ciiva.com/16741/pyu-rc0402-51-rohs-l-6-r-16741132.pdf?src-supplier=Future+Electronics; ComponentLink9URL: https://datasheet.ciiva.com/15189/getdatasheetpartid-330684-15189510.pdf?src-supplier=Verical; ComponentLink9Description: https://datasheet.ciiva.com/15189/getdatasheetpartid-330684-15189510.pdf?src-supplier=Verical; Supplier Part Number 1: 311-7.50KLRCT-ND; LCSC Part Number: C137934
R9 = RC0402FR-073K9L: RES 3.9K OHM 1% 1/16W 0402; Manufacturer: Yageo; Temperature Coefficient: 100ppm/°C; Power Rating: 62.5mW; Value: 3.9kR; Voltage Rating: 50V; Max Power Dissipation: 63mW; Item Type: Resistor; Supplier: Future Electronics; Supplier Part Number: 9808155; Manufacturer Part Number: RC0402FR-073K9L; RoHS: Yes; Category: Chip SMD Resistors; Stock: 6910000; Pricing: 10000=0.0011, 100000=0.0011, 300000=0.001, 750000=0.001, 2000000=0.0009 (USD); Case/Package: 0402; Case Code (Imperial): 0402; Case Code (Metric): 1005; Min Operating Temperature: -55°C; Max Operating Temperature: 155°C; Tolerance: 1%; Packaging: Tape and Reel; Resistor Type: Thick Film; Series: RC; Termination: SMD/SMT; Number of Terminations: 2; Features: Moisture Resistant; Resistance Tolerance: 1%; Construction: Rectangular; Voltage Rating (AC): 50V; Length: 1mm; Depth: 0.5mm; Lead Free: Lead Free; RoHS Compliant: Yes; Reach SVHC Compliant: Unknown; Military Standard: Not; ComponentLink1URL: https://datasheet.ciiva.com/12666/pyu-rc0402-51-rohs-l-6-r-12666997.pdf?src-supplier=Mouser; ComponentLink1Description: https://datasheet.ciiva.com/12666/pyu-rc0402-51-rohs-l-6-r-12666997.pdf?src-supplier=Mouser; ComponentLink2URL: https://datasheet.ciiva.com/7849/1018594-7849989.pdf?src-supplier=Element14; ComponentLink2Description: https://datasheet.ciiva.com/7849/1018594-7849989.pdf?src-supplier=Element14; ComponentLink3URL: https://datasheet.ciiva.com/7849/1018594-7849990.pdf?src-supplier=Element14; ComponentLink3Description: https://datasheet.ciiva.com/7849/1018594-7849990.pdf?src-supplier=Element14; ComponentLink4URL: https://datasheet.ciiva.com/15189/getdatasheetpartid-469246-15189453.pdf?src-supplier=Verical; ComponentLink4Description: https://datasheet.ciiva.com/15189/getdatasheetpartid-469246-15189453.pdf?src-supplier=Verical; LCSC Part Number: C131467
R10 = RC0402FR-07120KL: RES 120K OHM 1% 1/16W 0402; Manufacturer: Yageo; Resistance: 120kR; Power Rating: 63mW; Voltage Rating: 50V; Temperature Coefficient: 100ppm/°C; Item Type: Resistor; Supplier 1: Avnet; Manufacturer Part Number: RC0402FR-07120KL; RoHS: Yes; Category: Chip SMD Resistors; Stock 1: 12000; Pricing 1: 10000=0.00085 (USD); Case/Package: 0402; Case Code (Imperial): 0402; Case Code (Metric): 1005; Weight: 2.3E-05oz; Min Operating Temperature: -55°C; Max Operating Temperature: 155°C; Tolerance: 1%; Packaging: Tape and Reel; Package Quantity: 1; Termination: SMD/SMT; Resistor Type: Thick Film; Number of Terminations: 2; Max Power Dissipation: 63mW; Working Voltage: 50V; Features: Moisture Resistant; Series: RC; Resistance Tolerance: 1%; Technology: THICK FILM; Construction: Rectangular; Length: 1mm; Width: 0.02inch; Height: 0.016inch; Depth: 0.5mm; Military Standard: Not; Lead Free: Lead Free; RoHS Compliant: Yes; ComponentLink1URL: https://datasheet.ciiva.com/11808/0900766b80c66297-11808308.pdf?src-supplier=RSComponents; ComponentLink1Description: https://datasheet.ciiva.com/11808/0900766b80c66297-11808308.pdf?src-supplier=RSComponents; ComponentLink2URL: https://datasheet.ciiva.com/2453/pyu-r-int-thick-7-2453518.pdf?src-supplier=Digi-Key; ComponentLink2Description: https://datasheet.ciiva.com/2453/pyu-r-int-thick-7-2453518.pdf?src-supplier=Digi-Key; ComponentLink3URL: https://datasheet.ciiva.com/2453/pyu-r-int-thick-7-2453519.pdf?src-supplier=Digi-Key; ComponentLink3Description: https://datasheet.ciiva.com/2453/pyu-r-int-thick-7-2453519.pdf?src-supplier=Digi-Key; ComponentLink4URL: https://datasheet.ciiva.com/2453/pyu-r-int-thick-7-2453517.pdf?src-supplier=Digi-Key; ComponentLink4Description: https://datasheet.ciiva.com/2453/pyu-r-int-thick-7-2453517.pdf?src-supplier=Digi-Key; ComponentLink5URL: https://datasheet.ciiva.com/12577/pyu-rc0402-51-rohs-l-6-r-12577334.pdf?src-supplier=Mouser; ComponentLink5Description: https://datasheet.ciiva.com/12577/pyu-rc0402-51-rohs-l-6-r-12577334.pdf?src-supplier=Mouser; ComponentLink6URL: https://datasheet.ciiva.com/7849/1018594-7849829.pdf?src-supplier=Element14; ComponentLink6Description: https://datasheet.ciiva.com/7849/1018594-7849829.pdf?src-supplier=Element14; ComponentLink7URL: https://datasheet.ciiva.com/16741/pyu-rc0402-51-rohs-l-6-r-16741433.pdf?src-supplier=Future+Electronics; ComponentLink7Description: https://datasheet.ciiva.com/16741/pyu-rc0402-51-rohs-l-6-r-16741433.pdf?src-supplier=Future+Electronics; Supplier Part Number 1: RC0402FR-07120KL; LCSC Part Number: C93945
R11 = RC0402FR-071K5L: RES 1.5K OHM 1% 1/16W 0402; Manufacturer: Yageo; Resistance: 1.5kR; Power Rating: 62.5mW; Voltage Rating: 50V; Temperature Coefficient: 100ppm/°C; Max Power Dissipation: 63mW; Supplier 1: Digi-Key; Manufacturer Part Number: RC0402FR-071K5L; RoHS: Yes; Category: Chip SMD Resistors; Stock 1: 2832947; Pricing 1: 1=0.10000, 10=0.01500, 100=0.00610, 1000=0.00275, 2500=0.00239, 5000=0.00197 (USD); Case/Package: 0402; Case Code (Metric): 1005; Case Code (Imperial): 0402; Size Code: 0402; Min Operating Temperature: -55°C; Max Operating Temperature: 155°C; Resistor Type: Thick Film; Package Quantity: 1; Tolerance: 1%; Packaging: Tape and Reel; Number of Terminations: 2; Termination: SMD/SMT; Features: Moisture Resistant; Series: RC; Resistance Tolerance: 1%; Construction: Rectangular; Technology: THICK FILM; Length: 1mm; Width: 0.02inch; Height: 0.016inch; Depth: 0.5mm; RoHS Compliant: Yes; REACH SVHC: No SVHC; Military Standard: Not; Lead Free: Lead Free; ComponentLink1URL: https://datasheet.ciiva.com/11808/0900766b80c66297-11808238.pdf?src-supplier=RSComponents; ComponentLink1Description: https://datasheet.ciiva.com/11808/0900766b80c66297-11808238.pdf?src-supplier=RSComponents; ComponentLink2URL: https://datasheet.ciiva.com/46394/1018594-46394950.pdf?src-supplier=Element14; ComponentLink2Description: https://datasheet.ciiva.com/46394/1018594-46394950.pdf?src-supplier=Element14; ComponentLink3URL: https://datasheet.ciiva.com/2453/pyu-r-int-thick-7-2453440.pdf?src-supplier=Digi-Key; ComponentLink3Description: https://datasheet.ciiva.com/2453/pyu-r-int-thick-7-2453440.pdf?src-supplier=Digi-Key; ComponentLink4URL: https://datasheet.ciiva.com/2453/pyu-r-int-thick-7-2453441.pdf?src-supplier=Digi-Key; ComponentLink4Description: https://datasheet.ciiva.com/2453/pyu-r-int-thick-7-2453441.pdf?src-supplier=Digi-Key; ComponentLink5URL: https://datasheet.ciiva.com/2453/pyu-r-int-thick-7-2453439.pdf?src-supplier=Digi-Key; ComponentLink5Description: https://datasheet.ciiva.com/2453/pyu-r-int-thick-7-2453439.pdf?src-supplier=Digi-Key; ComponentLink6URL: https://datasheet.ciiva.com/12558/pyu-rc0402-51-rohs-l-6-r-8721-12558542.pdf?src-supplier=Mouser; ComponentLink6Description: https://datasheet.ciiva.com/12558/pyu-rc0402-51-rohs-l-6-r-8721-12558542.pdf?src-supplier=Mouser; ComponentLink7URL: https://datasheet.ciiva.com/7849/1018594-7849863.pdf?src-supplier=Element14; ComponentLink7Description: https://datasheet.ciiva.com/7849/1018594-7849863.pdf?src-supplier=Element14; ComponentLink8URL: https://datasheet.ciiva.com/7849/1018594-7849864.pdf?src-supplier=Element14; ComponentLink8Description: https://datasheet.ciiva.com/7849/1018594-7849864.pdf?src-supplier=Element14; ComponentLink9URL: https://datasheet.ciiva.com/15189/getdatasheetpartid-323992-15189370.pdf?src-supplier=Verical; ComponentLink9Description: https://datasheet.ciiva.com/15189/getdatasheetpartid-323992-15189370.pdf?src-supplier=Verical; Supplier Part Number 1: 311-1.50KLRCT-ND; LCSC Part Number: C114759
R12 = FRC0402F1910TS: 62.5mW Thick Film Resistors ±100ppm/℃ ±1% 191Ω 0402 Chip Resistor - Surface Mount ROHS; Manufacturer: FOJAN; Manufacturer Part Number: FRC0402F1910TS; Package: 0402; LCSC Part Number: C5126203; Item Type: Resistor; ComponentLink1Description: LCSC; ComponentLink1URL: https://www.lcsc.com/product-detail/Chip-Resistor-Surface-Mount_FOJAN-FRC0402F1910TS_C5126203.html
R13 = RC0402FR-07100RL: RES 100 OHM 1% 1/16W 0402; Manufacturer: Yageo; Power Rating: 62.5mW; Voltage Rating: 50V; Temperature Coefficient: 100ppm/°C; Max Power Dissipation: 63mW; Item Type: Resistor; Supplier 1: Mouser; Manufacturer Part Number: RC0402FR-07100RL; RoHS: Yes; Category: Chip SMD Resistors; Stock 1: 699545; Pricing 1: 1=0.10000, 10=0.01200, 50=0.01200, 100=0.00500, 1000=0.00300, 2500=0.00200, 10000=0.00100 (USD); Case/Package: 0402; Number of Pins: 2; Case Code (Imperial): 0402; Case Code (Metric): 1005; Size Code: 0402; Min Operating Temperature: -55°C; Max Operating Temperature: 155°C; Tolerance: 1%; Voltage Rating (DC): 50V; Resistance: 100R; Packaging: Tape and Reel; Termination: SMD/SMT; Resistor Type: Thick Film; Features: Moisture Resistant; Series: RC; Number of Terminations: 2; Resistance Tolerance: 1%; Construction: Rectangular; Technology: THICK FILM; Length: 1mm; Width: 0.5mm; Height: 0.32mm; Depth: 0.5mm; RoHS Compliant: Yes; REACH SVHC: No SVHC; Military Standard: Not; Lead Free: Lead Free; ComponentLink1URL: https://datasheet.ciiva.com/11808/0900766b80c66297-11808765.pdf?src-supplier=RSComponents; ComponentLink1Description: https://datasheet.ciiva.com/11808/0900766b80c66297-11808765.pdf?src-supplier=RSComponents; ComponentLink2URL: https://datasheet.ciiva.com/7849/1784430-7849810.pdf?src-supplier=Element14; ComponentLink2Description: https://datasheet.ciiva.com/7849/1784430-7849810.pdf?src-supplier=Element14; ComponentLink3URL: https://datasheet.ciiva.com/28367/1018594-28367226.pdf?src-supplier=Element14; ComponentLink3Description: https://datasheet.ciiva.com/28367/1018594-28367226.pdf?src-supplier=Element14; ComponentLink4URL: https://datasheet.ciiva.com/22747/1018594-22747511.pdf?src-supplier=Element14; ComponentLink4Description: https://datasheet.ciiva.com/22747/1018594-22747511.pdf?src-supplier=Element14; ComponentLink5URL: https://datasheet.ciiva.com/12667/pyu-rc0402-51-rohs-l-6-r-12667957.pdf?src-supplier=Mouser; ComponentLink5Description: https://datasheet.ciiva.com/12667/pyu-rc0402-51-rohs-l-6-r-12667957.pdf?src-supplier=Mouser; ComponentLink6URL: https://datasheet.ciiva.com/15189/getdatasheetpartid-329466-15189335.pdf?src-supplier=Verical; ComponentLink6Description: https://datasheet.ciiva.com/15189/getdatasheetpartid-329466-15189335.pdf?src-supplier=Verical; ComponentLink7URL: https://datasheet.ciiva.com/16740/pyu-rc0402-51-rohs-l-6-r-16740566.pdf?src-supplier=Future+Electronics; ComponentLink7Description: https://datasheet.ciiva.com/16740/pyu-rc0402-51-rohs-l-6-r-16740566.pdf?src-supplier=Future+Electronics; Supplier Part Number 1: 603-RC0402FR-07100RL; LCSC Part Number: C106232
R14 = RC0402FR-07470RL: RES 470 OHM 1% 1/16W 0402; Manufacturer: Yageo; Item Type: Resistor; Voltage Rating: 50V; Power Rating: 62.5mW; Temperature Coefficient: 100ppm/°C; Max Power Dissipation: 63mW; Supplier: Avnet; Supplier Part Number: RC0402FR-07470RL; Manufacturer Part Number: RC0402FR-07470RL; RoHS: Yes; Stock: 10000; Pricing: 10000=0.00085 (USD); Case/Package: 0402; Case Code (Metric): 1005; Case Code (Imperial): 0402; Min Operating Temperature: -55°C; Max Operating Temperature: 155°C; Packaging: Tape and Reel; Value: 470R; Tolerance: 1%; Number of Terminations: 2; Working Voltage: 50V; Package Quantity: 1; Resistor Type: Thick Film; Termination: SMD/SMT; Features: Moisture Resistant; Series: RC; Resistance Tolerance: 1%; Construction: Rectangular; Voltage Rating (AC): 50V; Length: 1mm; Width: 0.02inch; Height: 0.016inch; Depth: 0.5mm; Lead Free: Lead Free; Reach SVHC Compliant: No; RoHS Compliant: Yes; Military Standard: Not; ComponentLink1URL: https://datasheet.ciiva.com/46412/1018594-46412838.pdf?src-supplier=Element14; ComponentLink1Description: https://datasheet.ciiva.com/46412/1018594-46412838.pdf?src-supplier=Element14; ComponentLink2URL: https://datasheet.ciiva.com/2453/pyu-r-int-thick-7-2453377.pdf?src-supplier=Digikey; ComponentLink2Description: https://datasheet.ciiva.com/2453/pyu-r-int-thick-7-2453377.pdf?src-supplier=Digikey; ComponentLink3URL: https://datasheet.ciiva.com/2453/pyu-r-int-thick-7-2453378.pdf?src-supplier=Digikey; ComponentLink3Description: https://datasheet.ciiva.com/2453/pyu-r-int-thick-7-2453378.pdf?src-supplier=Digikey; ComponentLink4URL: https://datasheet.ciiva.com/2453/pyu-r-int-thick-7-2453376.pdf?src-supplier=Digikey; ComponentLink4Description: https://datasheet.ciiva.com/2453/pyu-r-int-thick-7-2453376.pdf?src-supplier=Digikey; ComponentLink5URL: https://datasheet.ciiva.com/7850/1018594-7850015.pdf?src-supplier=Element14; ComponentLink5Description: https://datasheet.ciiva.com/7850/1018594-7850015.pdf?src-supplier=Element14; ComponentLink6URL: https://datasheet.ciiva.com/7850/1018594-7850014.pdf?src-supplier=Element14; ComponentLink6Description: https://datasheet.ciiva.com/7850/1018594-7850014.pdf?src-supplier=Element14; ComponentLink7URL: https://datasheet.ciiva.com/15189/getdatasheetpartid-330246-15189463.pdf?src-supplier=Verical; ComponentLink7Description: https://datasheet.ciiva.com/15189/getdatasheetpartid-330246-15189463.pdf?src-supplier=Verical; LCSC Part Number: C114877
R15 = FRM121WFR004TM: 1W 4mΩ Current Sensing Resistors ±50ppm/℃ ±1% 1206 Current Sense Resistors / Shunt Resistors ROHS; Manufacturer: FOJAN; Manufacturer Part Number: FRM121WFR004TM; Package: 1206; LCSC Part Number: C7420009; Item Type: Resistor; ComponentLink1Description: LCSC; ComponentLink1URL: https://www.lcsc.com/product-detail/Current-Sense-Resistors-Shunt-Resistors_FOJAN-FRM121WFR004TM_C7420009.html
R16 = RC0402FR-072K49L: RES 2.49K OHM 1% 1/16W 0402; Manufacturer: Yageo; Item Type: Resistors; Value: 2.49kR; Temperature Coefficient: 100ppm/°C; Power Rating: 62.5mW; Voltage Rating: 50V; Max Power Dissipation: 63mW; Supplier: Future Electronics; Supplier Part Number: 7635139; Manufacturer Part Number: RC0402FR-072K49L; RoHS: Yes; Stock: 530000; Pricing: 10000=0.0012, 100000=0.0011, 300000=0.001, 750000=0.001, 2000000=0.0009 (USD); Case/Package: 0402; Case Code (Metric): 1005; Case Code (Imperial): 0402; Contact Plating: Tin,Lead; Min Operating Temperature: -55°C; Max Operating Temperature: 155°C; Tolerance: 1%; Resistor Type: Thick Film; Package Quantity: 1; Packaging: Tape and Reel; Number of Terminations: 2; Termination: SMD/SMT; Voltage Rating (DC): 50V; Features: Moisture Resistant; Series: RC; Resistance Tolerance: 1%; Length: 0.039inch; Width: 0.02inch; Height: 0.016inch; Reach SVHC Compliant: No; Lead Free: Lead Free; RoHS Compliant: Yes; ComponentLink1URL: https://datasheet.ciiva.com/2518/pyu-r-int-thick-7-2518986.pdf?src-supplier=Digikey; ComponentLink1Description: https://datasheet.ciiva.com/2518/pyu-r-int-thick-7-2518986.pdf?src-supplier=Digikey; ComponentLink2URL: https://datasheet.ciiva.com/2518/pyu-r-int-thick-7-2518987.pdf?src-supplier=Digikey; ComponentLink2Description: https://datasheet.ciiva.com/2518/pyu-r-int-thick-7-2518987.pdf?src-supplier=Digikey; ComponentLink3URL: https://datasheet.ciiva.com/7983/1018594-7983516.pdf?src-supplier=Element14; ComponentLink3Description: https://datasheet.ciiva.com/7983/1018594-7983516.pdf?src-supplier=Element14; ComponentLink4URL: https://datasheet.ciiva.com/2518/pyu-r-int-thick-7-2518985.pdf?src-supplier=Digikey; ComponentLink4Description: https://datasheet.ciiva.com/2518/pyu-r-int-thick-7-2518985.pdf?src-supplier=Digikey; ComponentLink5URL: https://datasheet.ciiva.com/5558/pyu-rc0402-51-rohs-l-6-r-5558122.pdf?src-supplier=Mouser; ComponentLink5Description: https://datasheet.ciiva.com/5558/pyu-rc0402-51-rohs-l-6-r-5558122.pdf?src-supplier=Mouser; LCSC Part Number: C145071
R17 = RC0603FR-0748K7L: RES 48.7K OHM 1% 1/10W 0603; Manufacturer: Yageo; Item Type: Resistor; Voltage Rating (DC): 50V; Supplier: Avnet; Supplier Part Number: 49AK2108; Manufacturer Part Number: RC0603FR-0748K7L; RoHS: Yes; Stock: 2423; Pricing: 1=0.104, 25=0.011, 50=0.009, 100=0.006 (USD); Lead Free: 5697LeadFree; ComponentLink1URL: https://datasheet.ciiva.com/2454/pyu-r-int-thick-7-2454495.pdf?src-supplier=Digikey; ComponentLink1Description: https://datasheet.ciiva.com/2454/pyu-r-int-thick-7-2454495.pdf?src-supplier=Digikey; ComponentLink2URL: https://datasheet.ciiva.com/2454/pyu-r-int-thick-7-2454496.pdf?src-supplier=Digikey; ComponentLink2Description: https://datasheet.ciiva.com/2454/pyu-r-int-thick-7-2454496.pdf?src-supplier=Digikey; ComponentLink3URL: https://datasheet.ciiva.com/2454/pyu-r-int-thick-7-2454497.pdf?src-supplier=Digikey; ComponentLink3Description: https://datasheet.ciiva.com/2454/pyu-r-int-thick-7-2454497.pdf?src-supplier=Digikey
R18 = RC0402FR-073K3L: RES 3.3K OHM 1% 1/16W 0402; Manufacturer: Yageo; Resistance: 3.3kR; Power Rating: 62.5mW; Voltage Rating: 50V; Temperature Coefficient: 100ppm/°C; Max Power Dissipation: 63mW; Item Type: Resistor; Supplier 1: Mouser; Manufacturer Part Number: RC0402FR-073K3L; RoHS: Yes; Category: Chip SMD Resistors; Stock 1: 2413047; Pricing 1: 1=0.10000, 10=0.01400, 50=0.01400, 100=0.00600, 1000=0.00300, 5000=0.00200, 10000=0.00100 (USD); Case/Package: 0402; Number of Pins: 2; Case Code (Imperial): 0402; Case Code (Metric): 1005; Size Code: 0402; Min Operating Temperature: -55°C; Max Operating Temperature: 155°C; Tolerance: 1%; Voltage Rating (DC): 50V; Packaging: Tape and Reel; Package Quantity: 1; Termination: SMD/SMT; Resistor Type: Thick Film; Number of Terminations: 2; Features: Moisture Resistant; Series: RC; Resistance Tolerance: 1%; Technology: THICK FILM; Construction: Rectangular; Length: 1mm; Width: 0.5mm; Height: 0.016inch; Depth: 0.5mm; RoHS Compliant: Yes; REACH SVHC: No SVHC; Military Standard: Not; Lead Free: Lead Free; ComponentLink1URL: https://datasheet.ciiva.com/11808/0900766b80c66297-11808441.pdf?src-supplier=RSComponents; ComponentLink1Description: https://datasheet.ciiva.com/11808/0900766b80c66297-11808441.pdf?src-supplier=RSComponents; ComponentLink2URL: https://datasheet.ciiva.com/46394/1018594-46394940.pdf?src-supplier=Element14; ComponentLink2Description: https://datasheet.ciiva.com/46394/1018594-46394940.pdf?src-supplier=Element14; ComponentLink3URL: https://datasheet.ciiva.com/2453/pyu-r-int-thick-7-2453395.pdf?src-supplier=Digi-Key; ComponentLink3Description: https://datasheet.ciiva.com/2453/pyu-r-int-thick-7-2453395.pdf?src-supplier=Digi-Key; ComponentLink4URL: https://datasheet.ciiva.com/2453/pyu-r-int-thick-7-2453396.pdf?src-supplier=Digi-Key; ComponentLink4Description: https://datasheet.ciiva.com/2453/pyu-r-int-thick-7-2453396.pdf?src-supplier=Digi-Key; ComponentLink5URL: https://datasheet.ciiva.com/2453/pyu-r-int-thick-7-2453394.pdf?src-supplier=Digi-Key; ComponentLink5Description: https://datasheet.ciiva.com/2453/pyu-r-int-thick-7-2453394.pdf?src-supplier=Digi-Key; ComponentLink6URL: https://datasheet.ciiva.com/16746/pyu-rc0402-51-rohs-l-6-r-16746361.pdf?src-supplier=Future+Electronics; ComponentLink6Description: https://datasheet.ciiva.com/16746/pyu-rc0402-51-rohs-l-6-r-16746361.pdf?src-supplier=Future+Electronics; Supplier Part Number 1: 603-RC0402FR-073K3L; LCSC Part Number: C137992